# EAGLE design Clock_Updated_3_Nets (EAGLE 7.2.0)
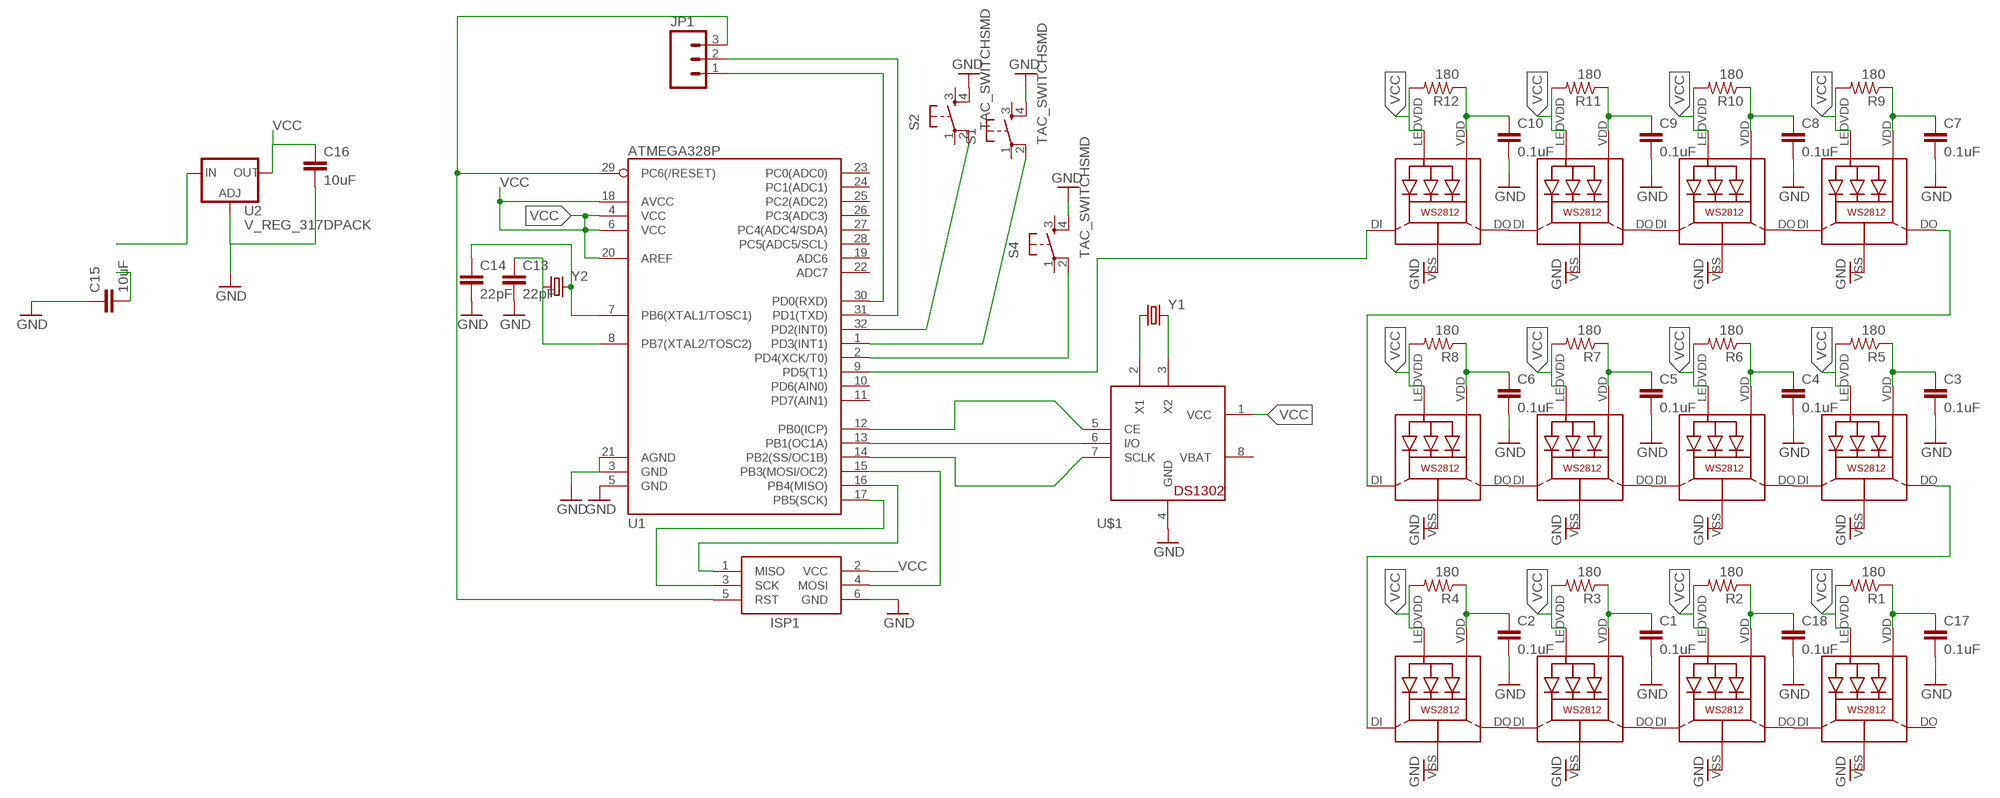
[diagram p0: schematic, sheet 1]

## Parts
C1  0.1uF  0.1UF-25V(+80/-20%)(0603)  [0603-CAP]
C2  0.1uF  0.1UF-25V(+80/-20%)(0603)  [0603-CAP]
C3  0.1uF  0.1UF-25V(+80/-20%)(0603)  [0603-CAP]
C4  0.1uF  0.1UF-25V(+80/-20%)(0603)  [0603-CAP]
C5  0.1uF  0.1UF-25V(+80/-20%)(0603)  [0603-CAP]
C6  0.1uF  0.1UF-25V(+80/-20%)(0603)  [0603-CAP]
C7  0.1uF  0.1UF-25V(+80/-20%)(0603)  [0603-CAP]
C8  0.1uF  0.1UF-25V(+80/-20%)(0603)  [0603-CAP]
C9  0.1uF  0.1UF-25V(+80/-20%)(0603)  [0603-CAP]
C10  0.1uF  0.1UF-25V(+80/-20%)(0603)  [0603-CAP]
C13  22pF  22PF-50V-5%(0603)  [0603-CAP]
C14  22pF  22PF-50V-5%(0603)  [0603-CAP]
C15  10uF  10UF-6.3V-20%(1206)  [1206]
C16  10uF  10UF-6.3V-20%(1206)  [1206]
C17  0.1uF  0.1UF-25V(+80/-20%)(0603)  [0603-CAP]
C18  0.1uF  0.1UF-25V(+80/-20%)(0603)  [0603-CAP]
ISP1  AVRISP-6  [AVRISP]
JP1  M03JST-PTH-VERT  [JST-3-PTH-VERT]
LED1  WS2812  [WS2812]
LED2  WS2812  [WS2812]
LED3  WS2812  [WS2812]
LED4  WS2812  [WS2812]
LED5  WS2812  [WS2812]
LED6  WS2812  [WS2812]
LED7  WS2812  [WS2812]
LED8  WS2812  [WS2812]
LED9  WS2812  [WS2812]
LED10  WS2812  [WS2812]
LED13  WS2812  [WS2812]
LED14  WS2812  [WS2812]
R1  180  180OHM1/10W1%(0603)  [0603-RES]
R2  180  180OHM1/10W1%(0603)  [0603-RES]
R3  180  180OHM1/10W1%(0603)  [0603-RES]
R4  180  180OHM1/10W1%(0603)  [0603-RES]
R5  180  180OHM1/10W1%(0603)  [0603-RES]
R6  180  180OHM1/10W1%(0603)  [0603-RES]
R7  180  180OHM1/10W1%(0603)  [0603-RES]
R8  180  180OHM1/10W1%(0603)  [0603-RES]
R9  180  180OHM1/10W1%(0603)  [0603-RES]
R10  180  180OHM1/10W1%(0603)  [0603-RES]
R11  180  180OHM1/10W1%(0603)  [0603-RES]
R12  180  180OHM1/10W1%(0603)  [0603-RES]
S1  TAC_SWITCHSMD  [TACTILE-SWITCH-SMD]
S2  TAC_SWITCHSMD  [TACTILE-SWITCH-SMD]
S4  TAC_SWITCHSMD  [TACTILE-SWITCH-SMD]
U1  ATMEGA328P  ATMEGA328_SMT  [TQFP32-08]
U2  V_REG_317DPACK  [V-REG_DPACK]
U$1  DS1302  [DIL08-ROUND]
Y1  CRYSTALTC38H  [TC38H]
Y2  CRYSTALSMD  [HC49UP]

## Nets
GND: C1.2 C2.2 C3.2 C4.2 C5.2 C6.2 C7.2 C8.2 C9.2 C10.2 C13.2 C14.2 C15.1 C16.2 C17.2 C18.2 ISP1.6(GND) LED1.VSS(GND) LED2.VSS(GND) LED3.VSS(GND) LED4.VSS(GND) LED5.VSS(GND) LED6.VSS(GND) LED7.VSS(GND) LED8.VSS(GND) LED9.VSS(GND) LED10.VSS(GND) LED13.VSS(GND) LED14.VSS(GND) S1.4 S2.4 S4.4 U1.3(GND) U1.5(GND) U1.21(AGND) U2.1(ADJ) U$1.4(GND)
N$1: ISP1.4(MOSI) U1.15(PB3(MOSI/OC2))
N$2: ISP1.1(MISO) U1.16(PB4(MISO))
N$3: JP1.1 U1.30(PD0(RXD))
N$4: S2.2 U1.32(PD2(INT0))
N$5: U$1.3(X2) Y1.2
N$6: U$1.2(X1) Y1.1
N$7: C1.1 LED1.VDD R3.1
N$8: LED1.LEDVDD R3.2
N$9: C2.1 LED2.VDD R4.1
N$10: LED2.LEDVDD R4.2
N$11: C3.1 LED3.VDD R5.1
N$12: LED3.LEDVDD R5.2
N$13: C4.1 LED4.VDD R6.1
N$14: LED4.LEDVDD R6.2
N$15: C5.1 LED5.VDD R7.1
N$16: LED5.LEDVDD R7.2
N$17: C6.1 LED6.VDD R8.1
N$18: LED6.LEDVDD R8.2
N$19: LED13.DI LED14.DO
N$20: LED1.DO LED14.DI
N$21: LED1.DI LED2.DO
N$22: LED3.DI LED4.DO
N$23: LED4.DI LED5.DO
N$24: LED5.DI LED6.DO
N$25: LED2.DI LED3.DO
N$26: C7.1 LED7.VDD R9.1
N$27: JP1.2 U1.31(PD1(TXD))
N$29: C17.1 LED13.VDD R1.1
N$30: S1.2 U1.1(PD3(INT1))
N$31: U1.13(PB1(OC1A)) U$1.6(I/O)
N$32: U1.12(PB0(ICP)) U$1.5(CE)
N$33: U1.14(PB2(SS/OC1B)) U$1.7(SCLK)
N$34: ISP1.3(SCK) U1.17(PB5(SCK))
N$35: LED13.LEDVDD R1.2
N$36: ISP1.5(RST) JP1.3 U1.29(PC6(/RESET))
N$37: S4.2 U1.2(PD4(XCK/T0))
N$38: C13.1 U1.8(PB7(XTAL2/TOSC2)) Y2.1
N$39: C18.1 LED14.VDD R2.1
N$40: LED7.LEDVDD R9.2
N$41: C8.1 LED8.VDD R10.1
N$42: LED8.LEDVDD R10.2
N$43: LED10.DI U1.9(PD5(T1))
N$44: C14.1 U1.7(PB6(XTAL1/TOSC1)) Y2.2
N$45: U2.3(IN)
N$46: LED14.LEDVDD R2.2
N$47: C9.1 LED9.VDD R11.1
N$48: LED9.LEDVDD R11.2
N$49: C10.1 LED10.VDD R12.1
N$50: LED10.LEDVDD R12.2
N$51: LED7.DI LED8.DO
N$52: LED8.DI LED9.DO
N$53: LED9.DI LED10.DO
N$55: LED6.DI LED7.DO
N$56: C15.2
VCC: C16.1 ISP1.2(VCC) U1.4(VCC) U1.6(VCC) U1.18(AVCC) U1.20(AREF) U2.4(OUT) U$1.1(VCC)
Unconnected: LED13.DO S1.1 S1.3 S2.1 S2.3 S4.1 S4.3 U1.10(PD6(AIN0)) U1.11(PD7(AIN1)) U1.19(ADC6) U1.22(ADC7) U1.23(PC0(ADC0)) U1.24(PC1(ADC1)) U1.25(PC2(ADC2)) U1.26(PC3(ADC3)) U1.27(PC4(ADC4/SDA)) U1.28(PC5(ADC5/SCL))

## Power pins joined to a net without a drawn wire
VBAT: U$1.8(VBAT)

## Library data of the parts
C1-C10 C17 C18 = SparkFun-Capacitors:0.1UF-25V(+80/-20%)(0603): CAP-00810 Ceramic Standard decoupling cap; PROD_ID: CAP-00810
C13 C14 = SparkFun-Capacitors:22PF-50V-5%(0603): CAP-07876; PROD_ID: CAP-07876
C15 C16 = SparkFun-Capacitors:10UF-6.3V-20%(1206): CAP-10057 Ceramic; PROD_ID: CAP-10057
ISP1 = adafruit:AVRISP: AVR ISP HEADER Standard 6 pin header for AVR programming
JP1 = SparkFun-Connectors:M03: Header 3 Standard 3-pin 0.1" header. Use with straight break away headers (SKU : PRT-00116), right angle break away headers (PRT-00553), swiss pins (PRT-00743), machine pins (PRT-00117), and female headers (PRT-00115). Molex polarized connector foot print use with SKU : PRT-08232 with associated crimp pins and housings.
LED1-LED10 LED13 LED14 = adafruit:WS2812
R1-R12 = SparkFun-Resistors:180OHM1/10W1%(0603): RES-08788; PROD_ID: RES-08788
S1 S2 S4 = SparkFun-Electromechanical:TAC_SWITCH: Momentary Switch Button commonly used for reset or general input. Spark Fun Electronics SKU : COM-00097 SMT- SWCH-08247; PROD_ID: SWCH-08247
U1 = SparkFun-DigitalIC:ATMEGA328_SMT: 32-Pin Atmega328 part Commonly used on Arduino compatible boards Available in QFP and QFN packages TQFP is IC-09069 QFN is non-stock; PROD_ID: IC-09069
U2 = SparkFun-PowerIC:V_REG_317: Voltage Regulator Standard LM317 adjustable voltage regulator. AOI (Adjust Output Input). Google 'LM317 Calculator' for easy to use app to get the two resistor values needed. 240/720 for 5V output. 240/390 for 3.3V output. Spark Fun Electronics SKU : COM-00527
U$1 = adafruit:DS1302: DS1302 - Real time clock with supercap trickle charger
Y1 Y2 = SparkFun-FreqCtrl:CRYSTAL: Various standard crystals. Proven footprints. Spark Fun Electronics SKU : COM-00534

## Board
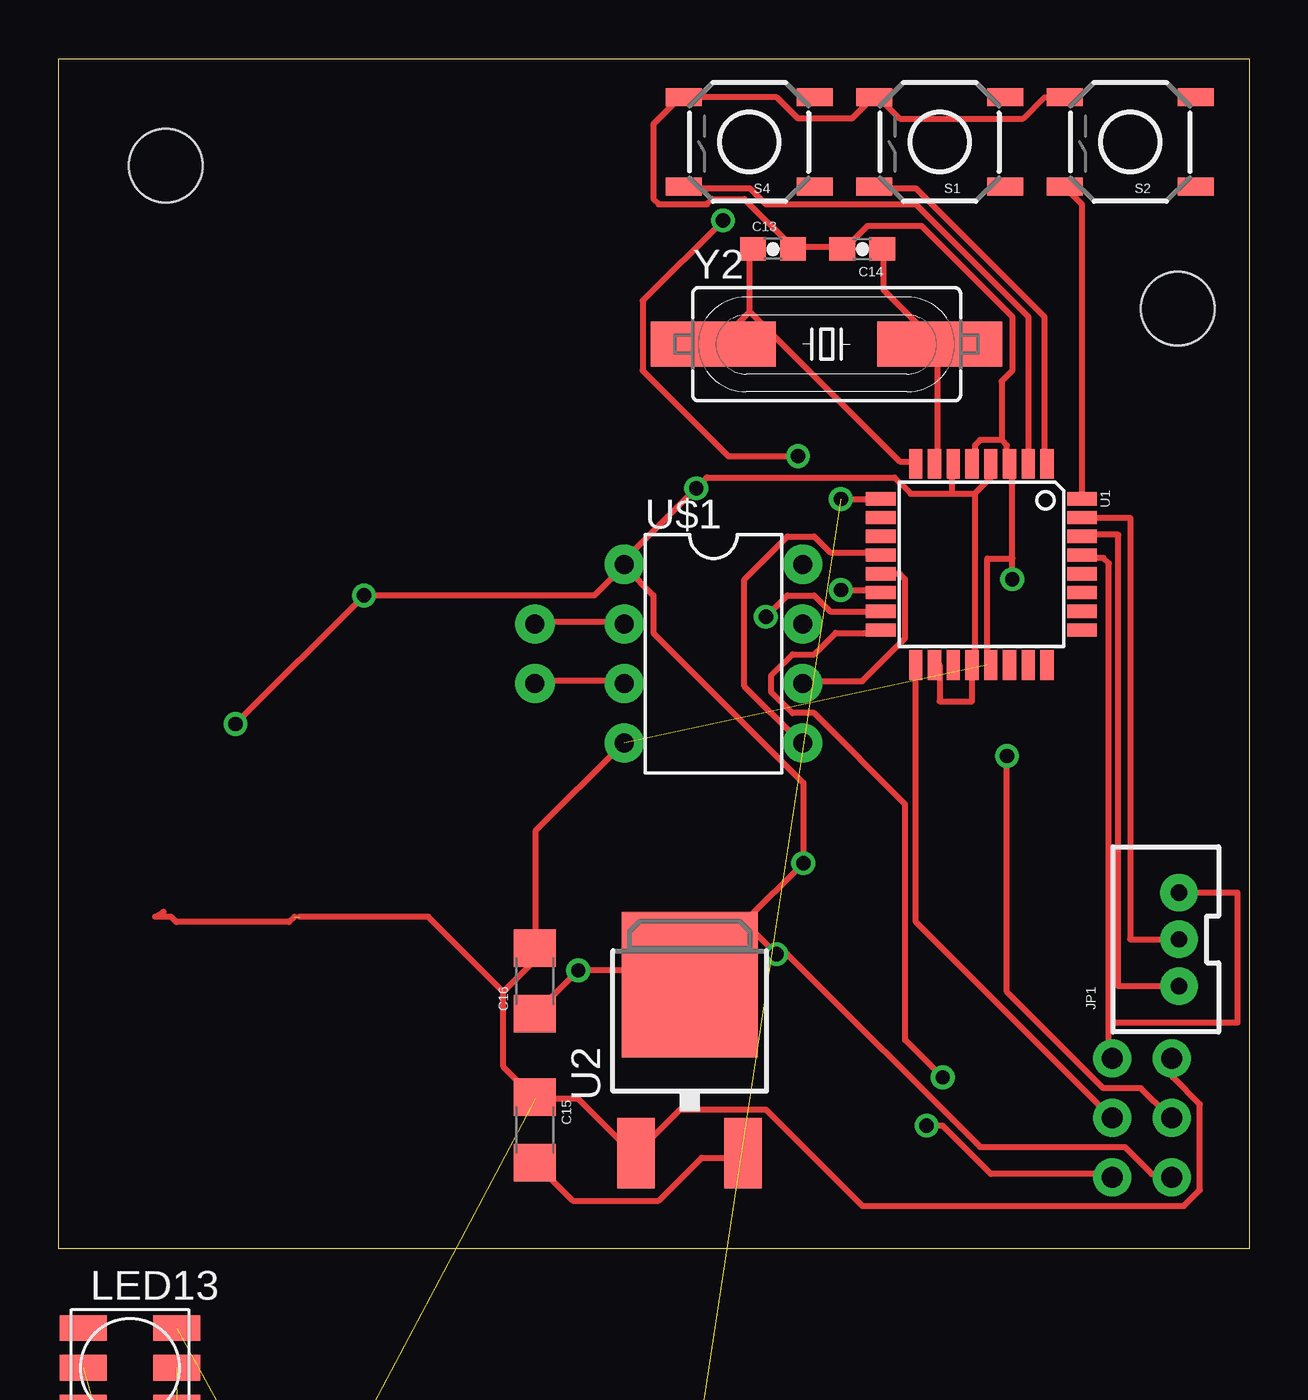
[diagram p1: board, top side]
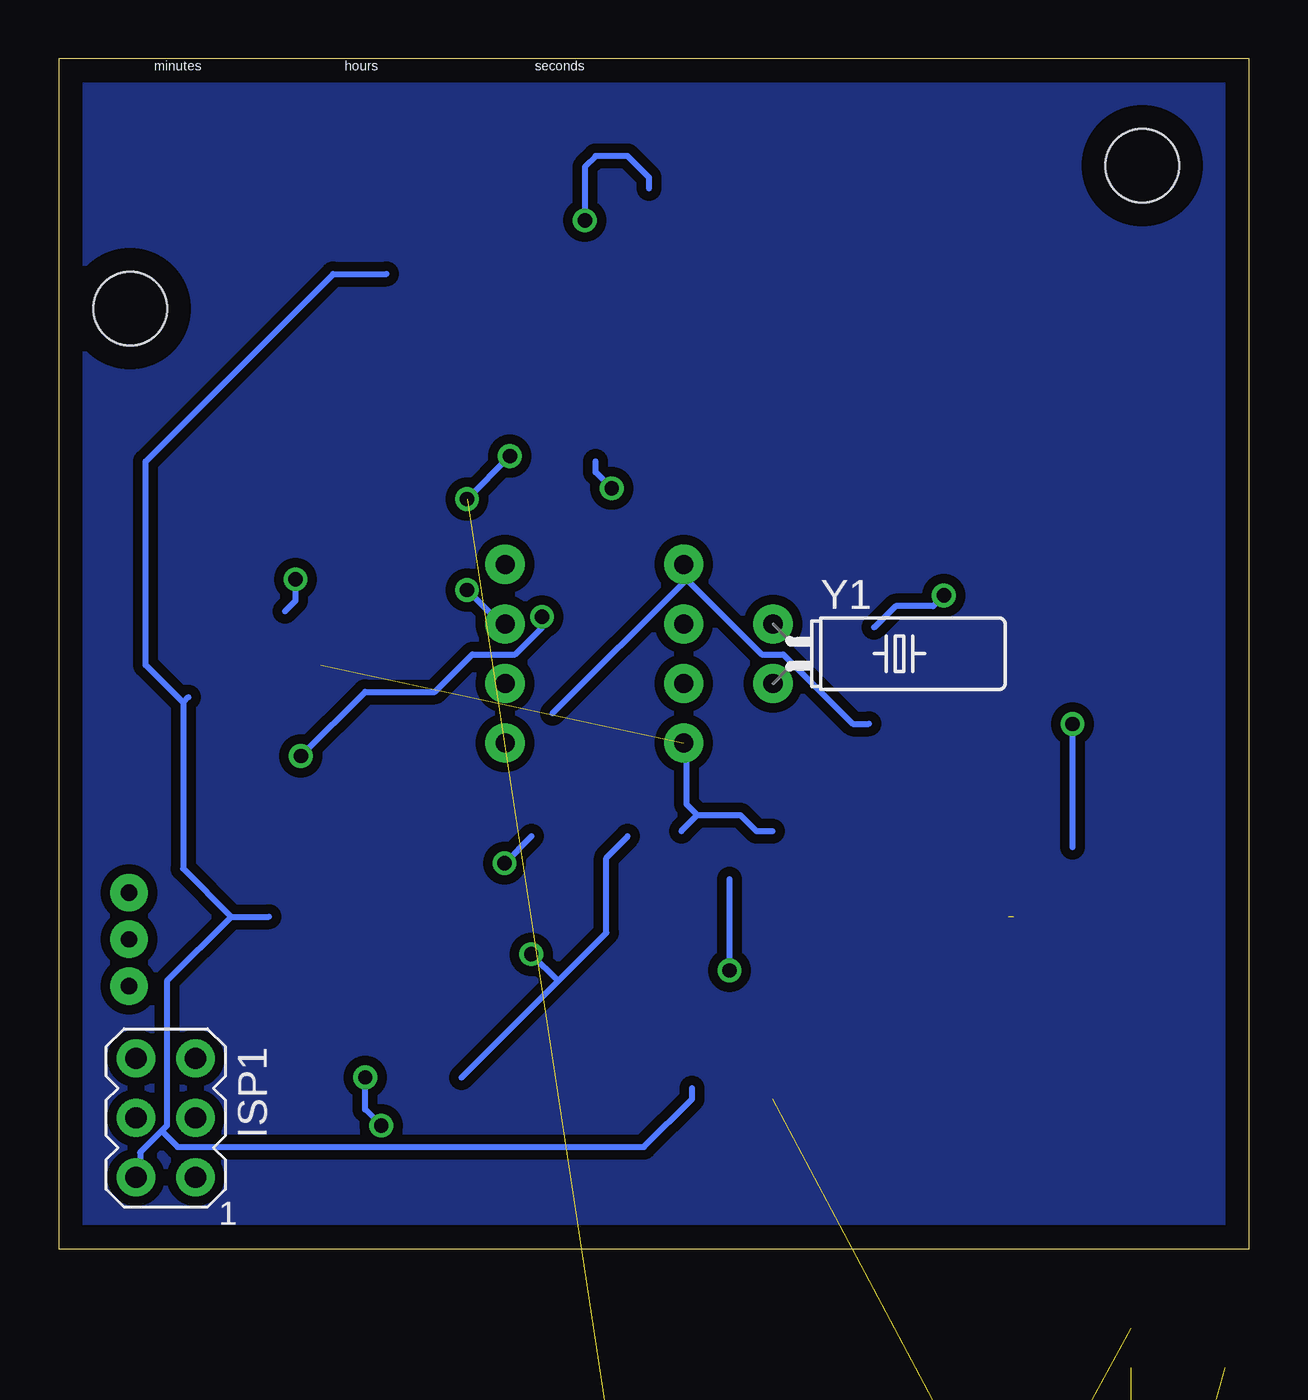
[diagram p2: board, bottom side, seen from below]

Size 50.8 x 50.8 mm. Coordinates in mm from the lower left corner, seen from the top.
Outline: 50.8,0 0,0 0,50.8 50.8,50.8 50.8,0
Copper layers (1*16): Top 0.035mm / dielectric 1.5mm / Bottom 0.035mm
Design rules "default": minimum track width 10mil, minimum drill 24mil, track to track 8mil, track to pad 8mil, pad to pad 8mil, via to via 8mil, smd to smd 8mil, copper to edge 40mil, drill to drill 8mil, minimum pad ring 10mil, minimum via ring 8mil, stop-mask expansion 4mil, vias tented up to drill 0mil, thermal gap 10mil
Holes 3.14 mm at 4.57,46.23 47.75,40.13

### Footprints (pad centres in the part's own frame; a part is rotated, then mirrored left to right if it is on the bottom)
0603-CAP = smd 1.1 x 1: 1 -0.85,0; 2 0.85,0
1206 = smd 1.6 x 1.8: 1 -1.4,0; 2 1.4,0
AVRISP = drill 0.9 pad 1.626: 1 -1.27,2.54; 2 1.27,2.54; 3 -1.27,0; 4 1.27,0; 5 -1.27,-2.54; 6 1.27,-2.54
JST-3-PTH-VERT = drill 0.7 pad 1.6: 1 -2,-0.55; 2 0,-0.55; 3 2,-0.55
WS2812 = smd 2 x 1.1: DI 2,0; DO 2,-1.7; LEDVDD -2,0; NC -2,1.7; VDD 2,1.7; VSS -2,-1.7
0603-RES = smd 1.1 x 1: 1 -0.85,0; 2 0.85,0
TACTILE-SWITCH-SMD = smd 1.524 x 0.762: 1 -2.794,1.905; 2 2.794,1.905; 3 -2.794,-1.905; 4 2.794,-1.905
TQFP32-08 = smd 1.27 x 0.559: 1 -4.293,2.8; 2 -4.293,2; 3 -4.293,1.2; 4 -4.293,0.4; 5 -4.293,-0.4; 6 -4.293,-1.2; 7 -4.293,-2; 8 -4.293,-2.8; 17 4.293,-2.8; 18 4.293,-2; 19 4.293,-1.2; 20 4.293,-0.4; 21 4.293,0.4; 22 4.293,1.2; 23 4.293,2; 24 4.293,2.8 | smd 0.559 x 1.27: 9 -2.8,-4.293; 10 -2,-4.293; 11 -1.2,-4.293; 12 -0.4,-4.293; 13 0.4,-4.293; 14 1.2,-4.293; 15 2,-4.293; 16 2.8,-4.293; 25 2.8,4.293; 26 2,4.293; 27 1.2,4.293; 28 0.4,4.293; 29 -0.4,4.293; 30 -1.2,4.293; 31 -2,4.293; 32 -2.8,4.293
V-REG_DPACK = smd 1.6 x 3: 1 -2.28,-4.8; 3 2.28,-4.8 | smd 5.8 x 6.2: 4 0,2.38
DIL08-ROUND = drill 0.813 pad 1.676: 1 -3.81,-3.81; 2 -1.27,-3.81; 3 1.27,-3.81; 4 3.81,-3.81; 5 3.81,3.81; 6 1.27,3.81; 7 -1.27,3.81; 8 -3.81,3.81
TC38H = drill 0.813 pad 1.676: 1 -1.27,0; 2 1.27,0
HC49UP = smd 5.334 x 1.93: 1 -4.826,0; 2 4.826,0

### Placement (x,y rotation side)
C1  10.16,-46.23 0 top  (outside the outline)
C2  1.52,-55.88 0 top  (outside the outline)
C3  1.52,-78.23 0 top  (outside the outline)
C4  4.57,-78.23 0 top  (outside the outline)
C5  7.62,-78.23 0 top  (outside the outline)
C6  10.67,-78.23 0 top  (outside the outline)
C7  1.52,-103.63 0 top  (outside the outline)
C8  4.57,-103.63 0 top  (outside the outline)
C9  7.62,-103.63 0 top  (outside the outline)
C10  10.67,-103.63 0 top  (outside the outline)
C13  30.48,42.67 0 top
C14  34.29,42.67 180 top
C15  20.32,5.08 270 top
C16  20.32,11.43 90 top
C17  10.16,-11.18 0 top  (outside the outline)
C18  1.52,-33.53 0 top  (outside the outline)
ISP1  46.23,5.59 180 bottom
JP1  47.24,13.21 90 top
LED1  3.05,-40.13 0 top  (outside the outline)
LED2  3.05,-49.78 0 top  (outside the outline)
LED3  3.05,-62.48 0 top  (outside the outline)
LED4  11.68,-62.48 0 top  (outside the outline)
LED5  3.05,-72.14 0 top  (outside the outline)
LED6  11.68,-72.14 0 top  (outside the outline)
LED7  3.05,-87.88 0 top  (outside the outline)
LED8  11.68,-87.88 0 top  (outside the outline)
LED9  3.05,-97.54 0 top  (outside the outline)
LED10  11.68,-97.54 0 top  (outside the outline)
LED13  3.05,-5.08 0 top  (outside the outline)
LED14  3.05,-27.43 0 top  (outside the outline)
R1  4.57,-20.83 0 top  (outside the outline)
R2  4.57,-33.53 0 top  (outside the outline)
R3  4.57,-55.88 0 top  (outside the outline)
R4  7.62,-55.88 0 top  (outside the outline)
R5  13.72,-78.23 0 top  (outside the outline)
R6  16.76,-78.23 0 top  (outside the outline)
R7  1.52,-81.28 0 top  (outside the outline)
R8  4.57,-81.28 0 top  (outside the outline)
R9  13.72,-103.63 0 top  (outside the outline)
R10  16.76,-103.63 0 top  (outside the outline)
R11  1.52,-106.68 0 top  (outside the outline)
R12  4.57,-106.68 0 top  (outside the outline)
S1  37.59,47.24 180 top
S2  45.72,47.24 180 top
S4  29.46,47.24 180 top
U1  39.37,29.21 270 top
U2  26.92,8.89 0 top
U$1  27.94,25.4 270 top
Y1  20.32,25.4 270 bottom
Y2  32.77,38.61 0 top

### Tracks (layer width: path | path; a pad name or v marks a point on that pad's centre or on a via)
GND  (via drill 0.61)  (26 unrouted)
  Top 0.254: 10.06,14.17 9.83,13.95 5.03,13.95 4.8,14.17 4.12,14.17 4.47,14.39 | 18.97,10.97 20.12,12.12 20.12,12.8 C16.2 20.34,13.03 20.34,17.83 24,21.49 U$1.4 | 18.97,10.97 18.97,7.77 20.12,6.63 C15.1 20.34,6.4 22.17,6.4 24.46,4.12 U2.1 24.69,4.12 26.52,5.94 30.18,5.94 34.29,1.83 48.01,1.83 48.69,2.52 48.69,6.17 47.55,7.32 47.55,8 ISP1.6 | 10.29,14.17 15.77,14.17 18.97,10.97 | 40.23,34.52 39.32,34.52 39.09,34.29 39.09,33.6 U1.5 | 40.23,34.52 40.46,34.29 40.46,33.6 U1.3 40.69,33.38 40.69,29.46 | S2.4 42.06,49.15 41.15,48.23 35.89,48.23 34.98,49.15 S1.4 34.75,49.15 33.83,48.23 31.55,48.23 30.63,49.15 S4.4 26.52,49.15 25.38,48.01 25.38,44.81 25.6,44.58 27.66,44.58 27.89,44.81 29.26,44.81 31.32,42.75 C13.2 31.55,42.75 33.38,42.75 C14.2 33.6,42.75 34.52,43.66 36.8,43.66 40.69,39.78 40.69,37.49 40.23,37.03 40.23,34.52 | v40.69,28.57 40.69,29.46 | U1.21 39.62,24.92 39.62,29.46 40.69,29.46
  Bottom 0.254: 20.34,17.83 21.03,17.83 21.72,18.52 23.55,18.52 | 24.23,17.83 23.55,18.52 | 23.55,18.52 24,18.97 24,21.49 U$1.4 | v40.69,28.57 40.69,27.66 41.15,27.2
N$1  (via drill 0.61)
  Top 0.254: v30.18,26.98 31.09,27.89 32.23,27.89 32.92,27.2 34.98,27.2 U1.15 | v40.46,21.03 40.46,10.97 44.58,6.86 46.18,6.86 47.32,5.71 ISP1.4
  Bottom 0.254: v30.18,26.98 30.18,26.52 31.32,25.38 33.15,25.38 34.75,23.77 37.72,23.77 v40.46,21.03
N$2  (via drill 0.61)
  Top 0.254: v37.72,7.32 36.12,8.91 36.12,18.97 32.23,22.86 31.32,22.86 30.4,23.77 30.4,24.46 31.32,25.38 32.23,25.38 33.15,26.29 34.98,26.29 U1.16 | v37.03,5.26 37.72,5.26 39.78,3.2 44.81,3.2 ISP1.1
  Bottom 0.254: v37.72,7.32 37.72,5.94 v37.03,5.26
N$3
  Top 0.254: JP1.1 45.21,11.21 45.21,30.48 43.66,30.48 U1.30
N$4
  Top 0.254: U1.32 43.66,44.58 42.98,45.26 S2.2
N$5
  Top 0.254: Y1.2 20.34,24.23 24,24.23 U$1.3
N$6
  Top 0.254: Y1.1 20.34,26.75 24,26.75 U$1.2
N$7  (2 unrouted)
N$8  (1 unrouted)
N$9  (2 unrouted)
N$10  (1 unrouted)
N$11  (2 unrouted)
N$12  (1 unrouted)
N$13  (2 unrouted)
N$14  (1 unrouted)
N$15  (2 unrouted)
N$16  (1 unrouted)
N$17  (2 unrouted)
N$18  (1 unrouted)
N$19  (1 unrouted)
N$20  (1 unrouted)
N$21  (1 unrouted)
N$22  (1 unrouted)
N$23  (1 unrouted)
N$24  (1 unrouted)
N$25  (1 unrouted)
N$26  (2 unrouted)
N$27
  Top 0.254: U1.31 45.72,31.21 45.72,13.21 JP1.2
N$28
  pour Bottom (isolate 0.406): 0.51,50.29 50.29,50.29 50.8,50.29 50.8,0 0,0 0,50.29
N$29  (2 unrouted)
N$30
  Top 0.254: U1.1 42.06,33.6 42.06,39.78 36.58,45.26 34.98,45.26 S1.2
N$31
  Top 0.254: U1.13 35.2,28.8 35.89,28.8 36.12,28.57 36.12,26.06 34.29,24.23 31.77,24.23 U$1.6
N$32
  Top 0.254: U1.12 34.98,29.72 32.92,29.72 32.23,30.4 31.09,30.4 29.26,28.57 29.26,24 31.55,21.72 U$1.5
N$33  (via drill 0.61)
  Top 0.254: v33.38,28.12 34.98,28.12 U1.14
  Bottom 0.254: v33.38,28.12 31.77,26.52 U$1.7
N$34
  Top 0.254: U1.17 36.58,13.95 44.81,5.71 ISP1.3
N$35  (1 unrouted)
N$36
  Top 0.254: 44.81,9.65 44.81,8.23 ISP1.5 | 44.81,9.65 44.81,29.26 44.58,29.49 43.66,29.49 U1.29 | JP1.3 50.29,15.21 50.29,9.65 44.81,9.65
N$37
  Top 0.254: U1.2 41.38,33.6 41.38,39.78 36.58,44.58 30.18,44.58 29.49,45.26 26.75,45.26 S4.2
N$38
  Top 0.254: 29.49,40.01 29.49,42.52 C13.1 | 29.49,40.01 28.12,38.63 Y2.1 | 29.49,40.01 35.89,33.6 36.35,33.6 U1.8
N$39  (2 unrouted)
N$40  (1 unrouted)
N$41  (2 unrouted)
N$42  (1 unrouted)
N$43  (via drill 0.61)  (1 unrouted)
  Top 0.254: v33.38,32 34.98,32 U1.9 | v31.55,33.83 28.57,33.83 24.92,37.49 24.92,40.46 v28.35,43.89
  Bottom 0.254: v31.55,33.83 v33.38,32 | v28.35,43.89 28.35,46.18 27.89,46.63 26.52,46.63 25.6,45.72 25.6,45.26
N$44
  Top 0.254: C14.1 35.2,42.52 35.2,40.92 37.49,38.63 Y2.2 37.49,38.41 37.49,33.6 U1.7
N$45
  Top 0.254: 20.34,3.66 21.95,2.06 25.6,2.06 27.43,3.89 29.03,3.89 U2.3
N$46  (1 unrouted)
N$47  (2 unrouted)
N$48  (1 unrouted)
N$49  (2 unrouted)
N$50  (1 unrouted)
N$51  (1 unrouted)
N$52  (1 unrouted)
N$53  (1 unrouted)
N$55  (1 unrouted)
VCC  (via drill 0.61)
  Top 0.254: C16.1 20.34,10.06 v22.17,11.89 26.29,11.89 26.75,11.43 | 26.75,11.43 29.26,13.95 | 29.26,13.95 v31.77,16.46 31.77,19.89 25.38,26.29 25.38,27.89 24.23,29.03 U$1.1 | 26.75,11.43 U2.4 29.26,13.95 | 29.26,13.95 v30.63,12.57 31.09,12.57 39.32,4.34 45.49,4.34 46.63,3.2 47.32,3.2 ISP1.2 | 39.09,32.23 39.09,24.92 U1.20 38.97,23.37 37.59,23.37 37.59,24.92 U1.18 | 39.09,32.23 39.78,32.92 39.78,33.38 U1.4 | U$1.1 24,29.03 22.86,27.89 v13.03,27.89 v7.54,22.4 | U$1.1 24,29.26 v27.2,32.46 27.66,32.92 35.66,32.92 36.35,32.23 38.1,32.23 | 38.1,32.23 39.09,32.23 | U1.6 38.1,33.5 38.1,32.23
  Bottom 0.254: 43.43,14.17 41.83,14.17 | 43.43,14.17 45.49,16.23 45.49,23.32 | 45.26,23.55 45.49,23.32 | 46.41,5.03 46.18,5.26 46.18,11.43 43.43,14.17 | 46.41,5.03 47.32,4.12 47.32,3.2 ISP1.2 | 23.77,6.86 23.77,6.4 25.83,4.34 45.72,4.34 46.41,5.03 | 26.52,17.6 27.43,16.69 27.43,13.49 29.49,11.43 | 33.6,7.32 29.49,11.43 | v22.17,11.89 22.17,15.77 | v31.77,16.46 30.63,17.6 | v30.63,12.57 29.49,11.43 | 16.23,22.4 16.92,22.4 19.89,25.38 20.8,25.38 24,28.57 | 24,28.57 24,29.03 U$1.1 24,28.57 | 16,26.52 15.09,27.43 13.49,27.43 v13.03,27.89 | 24,28.57 29.72,22.86 | 27.89,33.6 27.89,33.15 v27.2,32.46 | v7.54,22.4 7.54,17.14 | 36.8,41.6 39.09,41.6 47.09,33.6 47.09,24.92 45.49,23.32

### Text on the board
bPlace: seconds | hours | minutes